# EAGLE design ERC_Sch[1] (EAGLE 9.6.2)
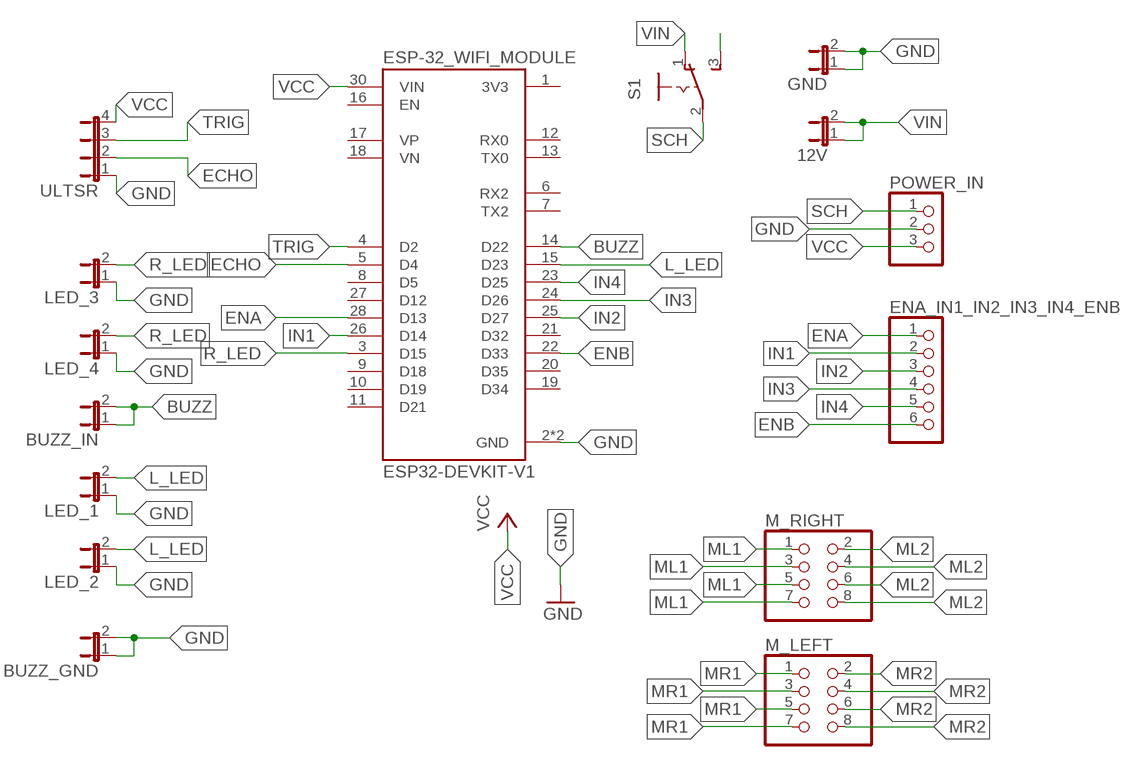
[diagram p0: schematic, sheet 1]

## Parts
12V  JP1E  [JP1]
BUZZ_GND  JP1E  [JP1]
BUZZ_IN  JP1E  [JP1]
ENA_IN1_IN2_IN3_IN4_ENB  PINHD-1X6  [1X06]
ESP-32_WIFI_MODULE  ESP32-DEVKIT-V1  [MODULE_ESP32_DEVKIT_V1]
GND  JP1E  [JP1]
LED_1  JP1E  [JP1]
LED_2  JP1E  [JP1]
LED_3  JP1E  [JP1]
LED_4  JP1E  [JP1]
M_LEFT  PINHD-2X4  [2X04]
M_RIGHT  PINHD-2X4  [2X04]
POWER_IN  PINHD-1X3  [1X03]
S1  255SB  [255SB]
ULTSR  JP4E  [JP4]

## Nets
BUZZ: BUZZ_IN.1 BUZZ_IN.2 ESP-32_WIFI_MODULE.14(D22)
ECHO: ESP-32_WIFI_MODULE.5(D4) ULTSR.2
ENA: ENA_IN1_IN2_IN3_IN4_ENB.1 ESP-32_WIFI_MODULE.28(D13)
ENB: ENA_IN1_IN2_IN3_IN4_ENB.6 ESP-32_WIFI_MODULE.22(D33)
GND: BUZZ_GND.1 BUZZ_GND.2 ESP-32_WIFI_MODULE.2(GND) ESP-32_WIFI_MODULE.29(GND) GND.1 GND.2 LED_1.1 LED_2.1 LED_3.1 LED_4.1 POWER_IN.2 ULTSR.1
IN1: ENA_IN1_IN2_IN3_IN4_ENB.2 ESP-32_WIFI_MODULE.26(D14)
IN2: ENA_IN1_IN2_IN3_IN4_ENB.3 ESP-32_WIFI_MODULE.25(D27)
IN3: ENA_IN1_IN2_IN3_IN4_ENB.4 ESP-32_WIFI_MODULE.24(D26)
IN4: ENA_IN1_IN2_IN3_IN4_ENB.5 ESP-32_WIFI_MODULE.23(D25)
L_LED: ESP-32_WIFI_MODULE.15(D23) LED_1.2 LED_2.2
ML1: M_RIGHT.1 M_RIGHT.3 M_RIGHT.5 M_RIGHT.7
ML2: M_RIGHT.2 M_RIGHT.4 M_RIGHT.6 M_RIGHT.8
MR1: M_LEFT.1 M_LEFT.3 M_LEFT.5 M_LEFT.7
MR2: M_LEFT.2 M_LEFT.4 M_LEFT.6 M_LEFT.8
N$2: S1.3(S)
R_LED: ESP-32_WIFI_MODULE.3(D15) LED_3.2 LED_4.2
SCH: POWER_IN.1 S1.2(P)
TRIG: ESP-32_WIFI_MODULE.4(D2) ULTSR.3
VCC: ESP-32_WIFI_MODULE.30(VIN) POWER_IN.3 ULTSR.4
VIN: 12V.1 12V.2 S1.1(O)
Unconnected: ESP-32_WIFI_MODULE.1(3V3) ESP-32_WIFI_MODULE.6(RX2) ESP-32_WIFI_MODULE.7(TX2) ESP-32_WIFI_MODULE.8(D5) ESP-32_WIFI_MODULE.9(D18) ESP-32_WIFI_MODULE.10(D19) ESP-32_WIFI_MODULE.11(D21) ESP-32_WIFI_MODULE.12(RX0) ESP-32_WIFI_MODULE.13(TX0) ESP-32_WIFI_MODULE.16(EN) ESP-32_WIFI_MODULE.17(VP) ESP-32_WIFI_MODULE.18(VN) ESP-32_WIFI_MODULE.19(D34) ESP-32_WIFI_MODULE.20(D35) ESP-32_WIFI_MODULE.21(D32) ESP-32_WIFI_MODULE.27(D12)

## Library data of the parts
12V BUZZ_GND BUZZ_IN GND LED_1-LED_4 = jumper:JP1E: JUMPER
ENA_IN1_IN2_IN3_IN4_ENB = adafruit:PINHD-1X6: PIN HEADER
ESP-32_WIFI_MODULE = ESP32-DEVKIT-V1:ESP32-DEVKIT-V1: Dual core, Wi-Fi: 2.4 GHz up to 150 Mbits/s,BLE (Bluetooth Low Energy) and legacy Bluetooth, 32 bits, Up to 240 MHz Check availability <https://pricing.snapeda.com/parts/ESP32-DEVKIT-V1/Do%20it/view-part?ref=eda>; AVAILABILITY: Not in stock; DESCRIPTION: Dual core, Wi-Fi: 2.4 GHz up to 150 Mbits/s,BLE (Bluetooth Low Energy) and legacy Bluetooth, 32 bits, Up to 240 MHz; MF: Do it; MP: ESP32-DEVKIT-V1; PACKAGE: None; PRICE: None
M_LEFT M_RIGHT = adafruit:PINHD-2X4: PIN HEADER
POWER_IN = adafruit:PINHD-1X3: PIN HEADER
S1 = switch:255SB: SLIDING SWITCH Distributor Buerklin, 11G810
ULTSR = jumper:JP4E: JUMPER

## Board
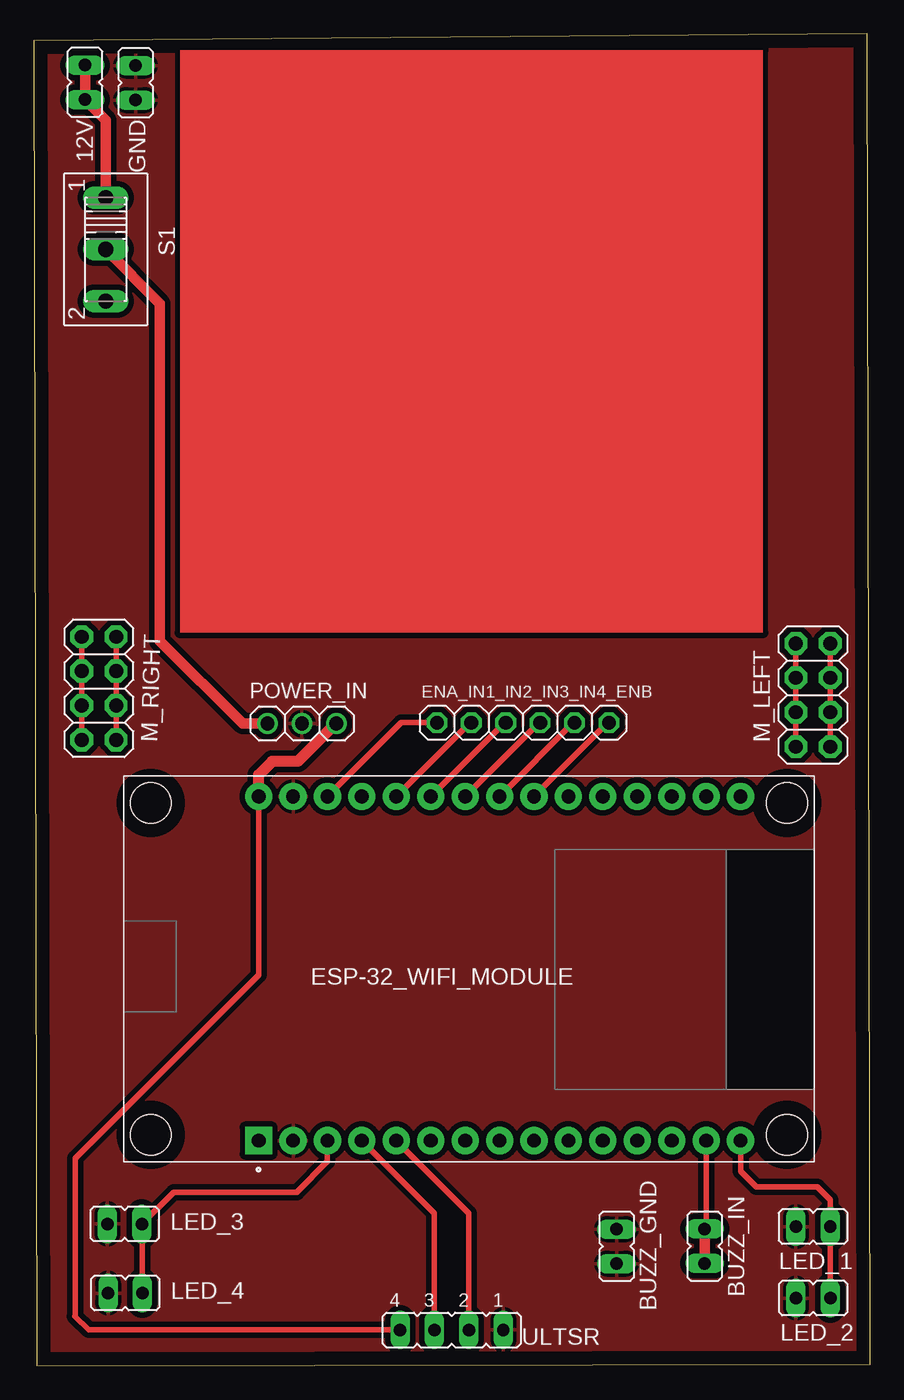
[diagram p1: board, top side]

Size 61.7 x 98.31 mm. Coordinates in mm from the lower left corner, seen from the top.
Outline: 0.2,0 61.7,0.1 61.5,98.31 0,97.81 0.2,0
Copper layers (1*16): Top 0.035mm / dielectric 1.5mm / Bottom 0.035mm
Design rules "default *": minimum track width 6mil, minimum drill 0.35mm, track to track 16mil, track to pad 16mil, pad to pad 16mil, via to via 16mil, smd to smd 6mil, copper to edge 40mil, drill to drill 6mil, minimum pad ring 10mil, minimum via ring 8mil, stop-mask expansion 4mil, vias tented up to drill 0mil, thermal gap 10mil

### Footprints (pad centres in the part's own frame; a part is rotated, then mirrored left to right if it is on the bottom)
JP1 = drill 0.914 long: 1 0,-1.27; 2 0,1.27
1X06 = drill 1.016 octagon: 1 -6.35,0; 2 -3.81,0; 3 -1.27,0; 4 1.27,0; 5 3.81,0; 6 6.35,0
MODULE_ESP32_DEVKIT_V1 = drill 1.02 pad 2 square: 1 -12.7,15.515 | drill 1.02 pad 2: 2 -12.7,12.975; 3 -12.7,10.435; 4 -12.7,7.895; 5 -12.7,5.355; 6 -12.7,2.815; 7 -12.7,0.275; 8 -12.7,-2.265; 9 -12.7,-4.805; 10 -12.7,-7.345; 11 -12.7,-9.885; 12 -12.7,-12.425; 13 -12.7,-14.965; 14 -12.7,-17.505; 15 -12.7,-20.045; 16 12.7,-20.045; 17 12.7,-17.505; 18 12.7,-14.965; 19 12.7,-12.425; 20 12.7,-9.885; 21 12.7,-7.345; 22 12.7,-4.805; 23 12.7,-2.265; 24 12.7,0.275; 25 12.7,2.815; 26 12.7,5.355; 27 12.7,7.895; 28 12.7,10.435; 29 12.7,12.975; 30 12.7,15.515 | hole 3: -12.28,-23.475; 12.23,-23.475; 12.23,23.475; -12.28,23.475
2X04 = drill 1.016 pad 1.676 octagon: 1 -3.81,-1.27; 2 -3.81,1.27; 3 -1.27,-1.27; 4 -1.27,1.27; 5 1.27,-1.27; 6 1.27,1.27; 7 3.81,-1.27; 8 3.81,1.27
1X03 = drill 1.016: 1 -2.54,0; 2 0,0; 3 2.54,0
255SB = drill 1.118 long: 1 -3.81,0; 2 0,0; 3 3.81,0
JP4 = drill 0.914 long: 1 -3.81,0; 2 -1.27,0; 3 1.27,0; 4 3.81,0

### Placement (x,y rotation side)
12V  3.78,94.73 180 top
BUZZ_GND  43,8.8 0 top
BUZZ_IN  49.5,8.82 0 top
ENA_IN1_IN2_IN3_IN4_ENB  36.09,47.46 0 top
ESP-32_WIFI_MODULE  32.1,29.31 90 top
GND  7.5,94.7 0 top
LED_1  57.5,10.26 270 top
LED_2  57.51,4.98 270 top
LED_3  6.7,10.46 270 top
LED_4  6.74,5.35 270 top
M_LEFT  57.5,49.5 90 top
M_RIGHT  4.8,50 90 top
POWER_IN  19.78,47.4 0 top
S1  5.3,82.4 270 top
ULTSR  30.83,2.64 180 top

### Tracks (layer width: path | path; a pad name or v marks a point on that pad's centre or on a via)
BUZZ
  Top 0.406: ESP-32_WIFI_MODULE.14 49.6,10.12 BUZZ_IN.2
  Top 0.762: BUZZ_IN.2 BUZZ_IN.1
ECHO
  Top 0.406: ESP-32_WIFI_MODULE.5 32.1,11.25 ULTSR.2
ENA
  Top 0.406: ENA_IN1_IN2_IN3_IN4_ENB.1 27.12,47.46 ESP-32_WIFI_MODULE.28
ENB
  Top 0.406: ENA_IN1_IN2_IN3_IN4_ENB.6 42.35,47.46 ESP-32_WIFI_MODULE.22
GND
  pour Top: -2.07,100.09 66.47,100.09 66.47,-2.44 -2.07,-2.44
IN1
  Top 0.406: ENA_IN1_IN2_IN3_IN4_ENB.2 32.2,47.46 ESP-32_WIFI_MODULE.26
IN2
  Top 0.406: ENA_IN1_IN2_IN3_IN4_ENB.3 34.73,47.46 ESP-32_WIFI_MODULE.25
IN3
  Top 0.406: ENA_IN1_IN2_IN3_IN4_ENB.4 37.27,47.46 ESP-32_WIFI_MODULE.24
IN4
  Top 0.406: ENA_IN1_IN2_IN3_IN4_ENB.5 39.81,47.46 ESP-32_WIFI_MODULE.23
L_LED
  Top 0.406: LED_2.2 58.77,4.99 LED_1.2 58.77,12.23 57.8,13.2 53.3,13.2 52.14,14.36 ESP-32_WIFI_MODULE.15
ML1
  Top 0.406: M_RIGHT.7 M_RIGHT.5 M_RIGHT.3 M_RIGHT.1
ML2
  Top 0.406: M_RIGHT.8 M_RIGHT.6 M_RIGHT.4 M_RIGHT.2
MR1
  Top 0.406: M_LEFT.7 M_LEFT.5 M_LEFT.3 M_LEFT.1
MR2
  Top 0.406: M_LEFT.8 M_LEFT.6 M_LEFT.4 M_LEFT.2
R_LED
  Top 0.406: ESP-32_WIFI_MODULE.3 21.66,15.06 19.4,12.8 10.31,12.8 LED_3.2 8.02,10.41 LED_4.2
SCH
  Top 0.762: S1.2 9.3,78.4 9.3,53.5 15.4,47.4 POWER_IN.1
TRIG
  Top 0.406: ESP-32_WIFI_MODULE.4 29.56,11.25 ULTSR.3
VCC
  Top 0.406: ULTSR.4 4.04,2.64 3.03,3.65 3.05,3.67 3.05,15.3 16.59,28.84 ESP-32_WIFI_MODULE.30
  Top 0.813: POWER_IN.3 22.28,47.4 19.48,44.61 17.59,44.61 16.59,43.61 ESP-32_WIFI_MODULE.30
VIN
  Top 0.762: 12V.1 12V.2 5.3,91.94 S1.1
(copper drawn outside any net)
  shapes: Top area x1